# EasyEDA Pro project 无刷双驱.epro, board PCB3
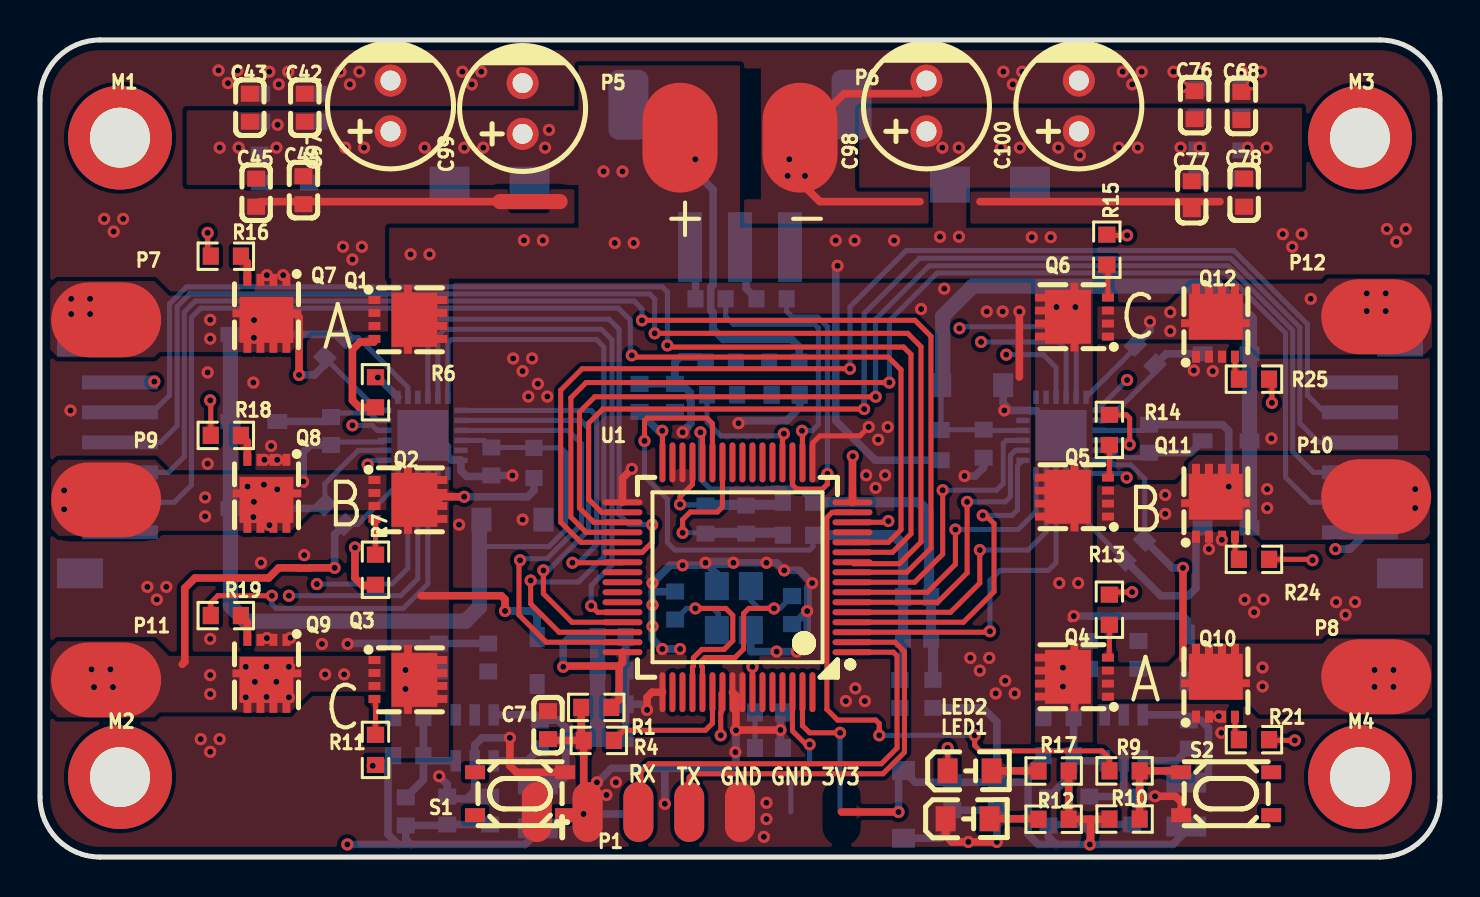
[diagram p2: board, top side]
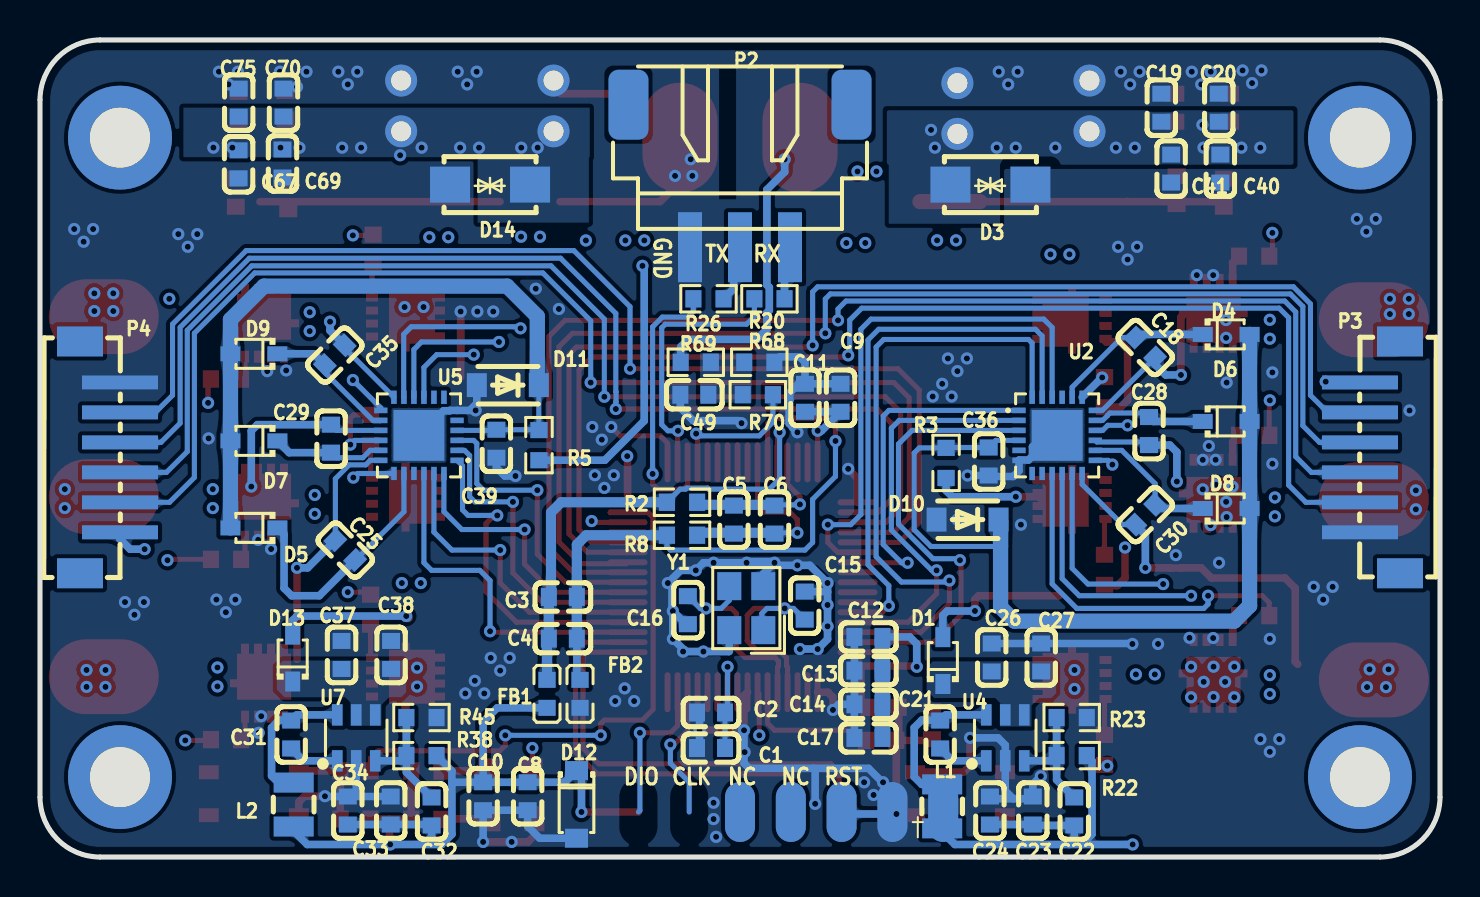
[diagram p3: board, bottom side, seen from below]

Outline 70 x 40.89 mm; copper layers: Top Layer, VCC, GND, Bottom Layer. Coordinates in mm from the lower left corner of the outline.
Outline path: 0,37.89 0,3 arc(0.88,0.88) 3,0 67,0 arc(69.12,0.88) 70,3 70,37.89 arc(69.12,40.01) 67,40.89 3,40.89 arc(0.88,40.01) 0,37.89
Stack: Top Layer 0.035mm 外层铜厚1oz / Dielectric1 0.2104mm 7628 RC49% 8.6mil / VCC 0.0152mm 内层铜厚 / Dielectric2 1.065mm 1.1mm H/HOZ Copper / GND 0.0152mm 内层铜厚 / Dielectric3 0.2104mm 7628 RC49% 8.6mil / Bottom Layer 0.035mm 外层铜厚1oz

## Design rules (mm)
net ECO_OUT: DP1
net ECO_IN: DP1
template: 自定义配置
spacing copperThickness1oz (default): track to track 0.102, other pairs 0.152 to 0.3
spacing copperThickness2oz: track to track 0.203, other pairs 0.152 to 0.3
track width copperThickness1oz (default): min 0.127, default 0.381, max 2.54
track width copperThickness2oz: min 0.203, default 0.254, max 2.54
differential pair differentialPair (default): width min 0.127, default 0.254, max 2.54; gap min 0.152, default 0.152
via viaSize (default): diameter min 0.5, default 0.61, max 10; hole min 0.3, default 0.305, max 6.299

## Placement (name value [footprint] x y rotation side)
C1  4.7uF  [C0603]  36.45 5.46 0 bottom
C2  100nF  [C0603]  36.45 7.23 0 bottom
C3  4.7uF  [C0603]  43.86 13.02 180 bottom
C4  100nF  [C0603]  43.86 10.93 0 bottom
C5  2.2uF  [C0603]  35.31 16.89 90 bottom
C6  100nF  [C0603]  33.27 16.89 270 bottom
C7  100nF  [C0603]  25.4 6.6 270 top
C8  4.7uF  [C0603]  45.62 3.04 270 bottom
C9  4.7uF  [C0603]  29.97 22.98 90 bottom
C10  100nF  [C0603]  47.84 3.04 270 bottom
C11  100nF  [C0603]  31.75 22.98 90 bottom
C12  4.7uF  [C0603]  28.58 11.01 180 bottom
C13  100nF  [C0603]  28.58 9.33 180 bottom
C14  4.7uF  [C0603]  28.58 7.64 180 bottom
C15  10pF  [C0603]  31.76 12.58 270 bottom
C16  10pF  [C0603]  37.61 12.35 270 bottom
C17  100nF  [C0603]  28.58 5.96 180 bottom
C18  4.7uF  [C0603]  14.74 25.5 225 bottom
C19  22uF  [C0603]  13.94 37.5 90 bottom
C20  22uF  [C0603]  11.06 37.5 90 bottom
C21  100nF  [C0603]  24.99 6.13 90 bottom
C22  220pF  [C0603]  18.29 2.28 270 bottom
C23  22uF  [C0603]  20.36 2.33 270 bottom
C24  100nF  [C0603]  22.5 2.33 270 bottom
C25  4.7uF  [C0603]  54.74 15.36 45 bottom
C26  22uF  [C0603]  22.41 9.99 90 bottom
C27  100nF  [C0603]  19.94 9.99 90 bottom
C28  4.7uF  [C0603]  14.55 21.32 270 bottom
C29  4.7uF  [C0603]  55.45 20.94 90 bottom
C30  4.7uF  [C0603]  14.74 17.13 315 bottom
C31  100nF  [C0603]  57.44 6.13 90 bottom
C32  220pF  [C0603]  50.42 2.28 270 bottom
C33  22uF  [C0603]  52.46 2.33 270 bottom
C34  100nF  [C0603]  54.61 2.33 270 bottom
C35  4.7uF  [C0603]  55.26 25.12 135 bottom
C36  22uF  [C0603]  22.57 19.79 270 bottom
C37  22uF  [C0603]  54.92 10.11 90 bottom
C38  100nF  [C0603]  52.45 10.11 90 bottom
C39  22uF  [C0603]  47.18 20.68 270 bottom
C40  22uF  [C0603]  10.98 34.45 270 bottom
C41  22uF  [C0603]  13.44 34.45 270 bottom
C42  22uF  [C0603]  13.24 37.5 90 top
C43  22uF  [C0603]  10.49 37.5 90 top
C44  22uF  [C0603]  13.17 33.37 270 top
C45  22uF  [C0603]  10.81 33.25 270 top
C49  100nF  [C0603]  37.28 23.14 180 bottom
C67  22uF  [C0603]  60.07 34.67 90 bottom
C68  22uF  [C0603]  60.07 37.59 270 top
C69  22uF  [C0603]  57.87 34.71 90 bottom
C70  22uF  [C0603]  57.83 37.75 270 bottom
C75  22uF  [C0603]  60.06 37.75 270 bottom
C76  22uF  [C0603]  57.73 37.63 270 top
C77  22uF  [C0603]  57.59 33.12 90 top
C78  22uF  [C0603]  60.21 33.25 90 top
C97  220uF  [CAP-TH_BD6.3-P2.50-D1.0-FD]  17.53 37.59 90 top
C98  220uF  [CAP-TH_BD6.3-P2.50-D1.0-FD]  44.32 37.59 90 top
C99  220uF  [CAP-TH_BD6.3-P2.50-D1.0-FD]  24.13 37.46 90 top
C100  220uF  [CAP-TH_BD6.3-P2.50-D1.0-FD]  51.94 37.59 90 top
D1  B5819WS-TP  [SOD-323_L1.8-W1.3-LS2.5-RD]  24.86 9.83 90 bottom
D3  SMAJ16CA  [SMA_L4.4-W2.6-LS5.0-BI]  22.48 33.65 180 bottom
D4  B5819WS-TP  [SOD-323_L1.8-W1.3-LS2.5-RD]  10.69 26.15 180 bottom
D5  B5819WS-TP  [SOD-323_L1.8-W1.3-LS2.5-RD]  59.3 16.47 0 bottom
D6  B5819WS-TP  [SOD-323_L1.8-W1.3-LS2.5-RD]  10.69 21.8 180 bottom
D7  B5819WS-TP  [SOD-323_L1.8-W1.3-LS2.5-RD]  59.3 20.83 0 bottom
D8  B5819WS-TP  [SOD-323_L1.8-W1.3-LS2.5-RD]  10.69 17.44 180 bottom
D9  B5819WS-TP  [SOD-323_L1.8-W1.3-LS2.5-RD]  59.3 25.18 0 bottom
D10  BZT52C15-7-F  [SOD-123F_L2.8-W1.8-LS3.7-RD]  23.62 16.89 0 bottom
D11  BZT52C15-7-F  [SOD-123F_L2.8-W1.8-LS3.7-RD]  46.61 23.62 0 bottom
D12  SMF3.3A  [SOD-123_L2.8-W1.8-LS3.7-RD]  43.17 2.64 270 bottom
D13  B5819WS-TP  [SOD-323_L1.8-W1.3-LS2.5-RD]  57.37 9.96 90 bottom
D14  SMAJ16CA  [SMA_L4.4-W2.6-LS5.0-BI]  47.5 33.65 180 bottom
FB1  BLM18PG121SN1D  [L0603]  44.65 8.17 90 bottom
FB2  BLM18PG121SN1D  [L0603]  43 8.17 90 bottom
L1  4.7uH  [IND-SMD_L2.5-W2.0_YXMBL252010P]  24.89 2.53 90 bottom
L2  4.7uH  [IND-SMD_L2.5-W2.0_YXMBL252010P]  57.32 2.63 90 bottom
LED1  YLED0805R  [LED0805-RD]  46.38 1.91 0 top
LED2  YLED0805R  [LED0805-RD]  46.48 4.31 0 top
M1  MountHole  [M3-MountHole-Plated]  4 36 0 top
M2  MountHole  [M3-MountHole-Plated]  4 4 0 top
M3  MountHole  [M3-MountHole-Plated]  66 36 0 top
M4  MountHole  [M3-MountHole-Plated]  66 4 0 top
P1  -  [HDR-M-2.54-2x5-DS]  35 2.25 270 top
P2  XH2.54-3P  [XH2.54-3P-SH]  35 35.5 0 bottom
P3  HX15001-6AB  [CONN-SMD_HX15001-6AB]  3 20 90 bottom
P4  HX15001-6AB  [CONN-SMD_HX15001-6AB]  67 20 270 bottom
P5  WirePad  [WirePad-4x6]  32 36 90 top
P6  WirePad  [WirePad-4x6]  38 36 90 top
P7  WirePad  [WirePad-4x6]  3.31 26.88 0 top
P8  WirePad  [WirePad-4x6]  66.81 9.02 0 top
P9  WirePad  [WirePad-4x6]  3.31 17.88 0 top
P10  WirePad  [WirePad-4x6]  66.81 18.03 0 top
P11  WirePad  [WirePad-4x6]  3.31 8.87 0 top
P12  WirePad  [WirePad-4x6]  66.81 27.04 0 top
Q1  TPN2R703NL,L1Q(M  [TSON-8_L3.1-W3.1-P0.65-LS3.3-BL-EP]  18.4 26.9 270 top
Q2  TPN2R703NL,L1Q(M  [TSON-8_L3.1-W3.1-P0.65-LS3.3-BL-EP]  18.4 17.89 270 top
Q3  TPN2R703NL,L1Q(M  [TSON-8_L3.1-W3.1-P0.65-LS3.3-BL-EP]  18.4 8.89 270 top
Q4  TPN2R703NL,L1Q(M  [TSON-8_L3.1-W3.1-P0.65-LS3.3-BL-EP]  51.72 9 90 top
Q5  TPN2R703NL,L1Q(M  [TSON-8_L3.1-W3.1-P0.65-LS3.3-BL-EP]  51.72 18.01 90 top
Q6  TPN2R703NL,L1Q(M  [TSON-8_L3.1-W3.1-P0.65-LS3.3-BL-EP]  51.72 27.02 90 top
Q7  TPN2R703NL,L1Q(M  [TSON-8_L3.1-W3.1-P0.65-LS3.3-BL-EP]  11.34 27.21 180 top
Q8  TPN2R703NL,L1Q(M  [TSON-8_L3.1-W3.1-P0.65-LS3.3-BL-EP]  11.34 18.2 180 top
Q9  TPN2R703NL,L1Q(M  [TSON-8_L3.1-W3.1-P0.65-LS3.3-BL-EP]  11.34 9.19 180 top
Q10  TPN2R703NL,L1Q(M  [TSON-8_L3.1-W3.1-P0.65-LS3.3-BL-EP]  58.77 8.7 0 top
Q11  TPN2R703NL,L1Q(M  [TSON-8_L3.1-W3.1-P0.65-LS3.3-BL-EP]  58.77 17.71 0 top
Q12  TPN2R703NL,L1Q(M  [TSON-8_L3.1-W3.1-P0.65-LS3.3-BL-EP]  58.77 26.71 0 top
R1  10kΩ  [R0603]  27.81 7.49 180 top
R2  0R  [R0603]  37.9 17.75 180 bottom
R3  100R  [R0603]  24.7 19.72 270 bottom
R4  100Ω  [R0603]  27.94 5.84 180 top
R5  100R  [R0603]  45.05 20.61 270 bottom
R6  4.7R  [R0603]  16.78 23.26 90 top
R7  4.7R  [R0603]  16.78 14.38 270 top
R8  0R  [R0603]  37.9 16.1 180 bottom
R9  100R  [R0603]  54.23 4.31 0 top
R10  4.7K  [R0603]  54.23 1.9 0 top
R11  4.7R  [R0603]  16.78 5.36 270 top
R12  1kΩ  [R0603]  50.68 1.89 180 top
R13  4.7R  [R0603]  53.47 12.38 90 top
R14  4.7R  [R0603]  53.47 21.38 90 top
R15  4.7R  [R0603]  53.34 30.39 90 top
R16  4.7R  [R0603]  9.29 30.07 180 top
R17  1kΩ  [R0603]  50.68 4.3 180 top
R18  4.7R  [R0603]  9.29 21.1 180 top
R19  4.7R  [R0603]  9.29 12.08 180 top
R20  100R  [R0603]  33.53 27.94 0 bottom
R21  4.7R  [R0603]  60.7 5.87 0 top
R22  73.2K  [R0603]  18.41 5.08 180 bottom
R23  10K  [R0603]  18.41 6.98 0 bottom
R24  4.7R  [R0603]  60.7 14.9 0 top
R25  4.7R  [R0603]  60.7 23.92 0 top
R26  100R  [R0603]  36.58 27.94 0 bottom
R38  45.3K  [R0603]  50.93 5.08 180 bottom
R45  10K  [R0603]  50.93 6.98 0 bottom
R68  1kΩ  [R0603]  34.04 24.76 0 bottom
R69  10kΩ  [R0603]  37.21 24.76 0 bottom
R70  100R  [R0603]  34.11 23.14 180 bottom
S1  TS1145A26025  [SW-SMD_4P-L4.2-W3.2-P2.15-LS4.6]  24 3.17 180 top
S2  TS1145A26025  [SW-SMD_4P-L4.2-W3.2-P2.15-LS4.6]  59.31 3.17 0 top
U1  CYT2BL3CAAQ0AZEGST  [LQFP-64_L10.0-W10.0-P0.50-LS12.0-BL]  34.87 14 90 top
U2  FD6288Q  [QFN-24_L4.0-W4.0-P0.50-BL-EP2.6]  19.14 21.1 270 bottom
U4  RY9121E  [SOT-23-6_L2.9-W1.6-P0.95-LS2.8-BL]  21.74 5.96 180 bottom
U5  FD6288Q  [QFN-24_L4.0-W4.0-P0.50-BL-EP2.6]  51.05 21.1 90 bottom
U7  RY9121E  [SOT-23-6_L2.9-W1.6-P0.95-LS2.8-BL]  54.19 5.96 180 bottom
Y1  20pF16MHz  [CRYSTAL-SMD_4P-L3.2-W2.5-BL]  34.69 12.45 90 bottom

## Footprints (pads in the part's own frame, mm; a bottom-side part is the same pattern mirrored in y, then rotated)
C0603
  rect 0.8x0.9 smd: 1(-0.7,0) 2(0.7,0)
CAP-TH_BD6.3-P2.50-D1.0-FD
  round 1.6 hole 1: 1(-1.27,0) 2(1.27,0)
CONN-SMD_HX15001-6AB
  rect 0.7x3.8 smd: 1(-3.75,1) 2(-2.25,1) 3(-0.75,1) 4(0.75,1) 5(2.25,1) 6(3.75,1)
  rect 1.5x2.3 smd: 7(5.8,-1) 8(-5.8,-1)
CRYSTAL-SMD_4P-L3.2-W2.5-BL
  rect 1.4x1.2 smd: 1(-1.1,-0.85) 2(1.1,-0.85) 3(1.1,0.85) 4(-1.1,0.85)
HDR-M-2.54-2x5-DS
  oval 3x1.5 smd: 1(0,0) 3(0,-2.54) 5(0,-5.08) 7(0,-7.62) 9(0,-10.16)
  oval 3x1.5 smd far side: 2(0,0) 4(0,-2.54) 6(0,-5.08) 8(0,-7.62) 10(0,-10.16)
IND-SMD_L2.5-W2.0_YXMBL252010P
  rect 1x2 smd: 1(1.1,0) 2(-1.1,0)
L0603
  rect 0.8x0.864 smd: 1(-0.7,0) 2(0.7,0)
LED0805-RD
  rect 1x1.25 smd: 1(-1.1,0) 2(1.1,0)
LQFP-64_L10.0-W10.0-P0.50-LS12.0-BL
  oval 0.3x2 smd: 1(-3.75,-5.75) 2(-3.25,-5.75) 3(-2.75,-5.75) 4(-2.25,-5.75) 5(-1.75,-5.75) 6(-1.25,-5.75) 7(-0.75,-5.75) 8(-0.25,-5.75) 9(0.25,-5.75) 10(0.75,-5.75) 11(1.25,-5.75) 12(1.75,-5.75) 13(2.25,-5.75) 14(2.75,-5.75) 15(3.25,-5.75) 16(3.75,-5.75) 33(3.75,5.75) 34(3.25,5.75) 35(2.75,5.75) 36(2.25,5.75) 37(1.75,5.75) 38(1.25,5.75) 39(0.75,5.75) 40(0.25,5.75) 41(-0.25,5.75) 42(-0.75,5.75) 43(-1.25,5.75) 44(-1.75,5.75) 45(-2.25,5.75) 46(-2.75,5.75) 47(-3.25,5.75) 48(-3.75,5.75)
  oval 2x0.3 smd: 17(5.75,-3.75) 18(5.75,-3.25) 19(5.75,-2.75) 20(5.75,-2.25) 21(5.75,-1.75) 22(5.75,-1.25) 23(5.75,-0.75) 24(5.75,-0.25) 25(5.75,0.25) 26(5.75,0.75) 27(5.75,1.25) 28(5.75,1.75) 29(5.75,2.25) 30(5.75,2.75) 31(5.75,3.25) 32(5.75,3.75) 49(-5.75,3.75) 50(-5.75,3.25) 51(-5.75,2.75) 52(-5.75,2.25) 53(-5.75,1.75) 54(-5.75,1.25) 55(-5.75,0.75) 56(-5.75,0.25) 57(-5.75,-0.25) 58(-5.75,-0.75) 59(-5.75,-1.25) 60(-5.75,-1.75) 61(-5.75,-2.25) 62(-5.75,-2.75) 63(-5.75,-3.25) 64(-5.75,-3.75)
M3-MountHole-Plated
  round 5.2 hole 3: 1(0,0)
QFN-24_L4.0-W4.0-P0.50-BL-EP2.6
  rect 0.28x0.665 smd: 1(-1.25,-1.907) 2(-0.75,-1.907) 3(-0.25,-1.907) 4(0.25,-1.907) 5(0.75,-1.907) 6(1.25,-1.907) 13(1.25,1.907) 14(0.75,1.907) 15(0.25,1.907) 16(-0.25,1.907) 17(-0.75,1.907) 18(-1.25,1.907)
  rect 0.665x0.28 smd: 7(1.907,-1.25) 8(1.907,-0.75) 9(1.907,-0.25) 10(1.907,0.25) 11(1.907,0.75) 12(1.907,1.25) 19(-1.907,1.25) 20(-1.907,0.75) 21(-1.907,0.25) 22(-1.907,-0.25) 23(-1.907,-0.75) 24(-1.907,-1.25)
  rect 2.55x2.55 smd: 25(0,0)
R0603
  rect 0.806x0.864 smd: 1(-0.753,0) 2(0.753,0)
SMA_L4.4-W2.6-LS5.0-BI
  rect 2x1.8 smd: 1(-2,0) 2(2,0)
SOD-123_L2.8-W1.8-LS3.7-RD
  rect 0.95x1.15 smd: 1(-1.692,0) 2(1.692,0)
SOD-123F_L2.8-W1.8-LS3.7-RD
  rect 1x1.2 smd: 1(-1.55,0) 2(1.55,0)
SOD-323_L1.8-W1.3-LS2.5-RD
  rect 1x0.75 smd: 1(-1.173,0) 2(1.173,0)
SOT-23-6_L2.9-W1.6-P0.95-LS2.8-BL
  rect 0.532x1.072 smd: 1(-0.95,-1.149) 2(0,-1.149) 3(0.95,-1.149) 4(0.95,1.149) 5(0,1.149) 6(-0.95,1.149)
SW-SMD_4P-L4.2-W3.2-P2.15-LS4.6
  rect 1x0.7 smd: 1(-2.25,1.075) 2(2.25,1.075) 3(-2.25,-1.075) 4(2.25,-1.075)
TSON-8_L3.1-W3.1-P0.65-LS3.3-BL-EP
  rect 0.4x0.6 smd: 1(-0.975,-1.675) 2(-0.325,-1.675) 3(0.325,-1.675) 4(0.975,-1.675) 5(0.975,1.675) 6(0.325,1.675) 7(-0.325,1.675) 8(-0.975,1.675)
  rect 0.6x0.4 smd: 9(-1.42,0) 9(1.42,0)
  rect 2.7x2.3 smd: 9(0.02,0.325)
WirePad-4x6
  rrect 5.5x3.75 smd: 1(0,0)
XH2.54-3P-SH
  rrect 2x3.5 smd: 0(-5.577,-2.15) 0(5.577,-2.15)
  rect 1.2x3.5 smd: 1(-2.5,4.981) 2(0,4.981) 3(2.5,4.981)

## Nets
As in the schematic.

Pads without a net: M1 1; M2 1; M3 1; M4 1; P1 6 8; P2 0; P3 7 8; P4 7 8; S1 2 4; S2 2 4; U1 13 21 22 23 24 25 30 31 40 41 42 43 50 51 59 60 61 64; U2 5 7 8 21; U5 5 7 8 21

## Via types
v1: diameter 0.61, hole 0.305, Top Layer to Bottom Layer, 316 vias

## Routing (per net, layer and track width the routed paths; a pad name or vN(x,y) marks a point on that pad's centre or on a via; arc(x,y) is an arc through that point)
GND: length 161.5
  Top Layer w0.254: v1(41.44,21.52) 40.99,21.08 38.99,21.08 38.62,20.71 U1.17
  Top Layer w0.381: 11,32.8 23,32.8 ; U1.56 34.8,8.08 v1(34.8,6.34) 34.81,6.36 v1(37.02,6.36) ; v1(47.84,0.76) v1(46.42,0.76) 45.59,0.76 45.28,1.07 LED1.1 ; 47,32.8 59,32.8 ; v1(55.75,3.04) 56.77,3.04 57.06,2.75 S2.3 ; v1(30.35,7.36) 30.35,8 30.61,8.25 U1.49 ; S1.3 23.82,4.25 23.5,4.57 v1(23.5,5.96) ; 44,32.8 38.99,32.8 38,33.79 P6.1 40.2,38.2 44,38.2 ; v1(29.59,19.43) 29.12,18.96 U1.33 ; 48.97,24.02 v1(48.97,27.3)
  Top Layer w0.762: 23,32.8 26,32.8
  Bottom Layer w0.381: v1(34.67,14.73) v1(36.32,14.73) 36.83,14.73 v1(37.21,14.35) 37.97,14.35 v1(38.61,13.71) 38.4,13.5 38.4,12.51 38.36,12.47 v1(38.36,12.31) ; C1.2 37.02,5.58 v1(37.02,6.36) 37.02,7.11 C2.2 ; R68.1 33.01,25.03 32.02,25.03 31.75,24.76 C11.2 ; v1(46.23,19.07) 46.76,19.07 47.18,19.49 C39.2 ; v1(38.36,12.31) 38.36,10.92 v1(38.35,10.92) 37.85,10.41 v1(37.85,10.28) v1(36.83,10.28) 35.56,10.28 35.53,10.31 Y1.4 ; v1(38.36,12.31) 37.7,11.65 C16.2 ; 30.62,13.26 v1(30.62,13.71) 31.51,14.6 v1(32.13,14.6) 33.15,14.6 v1(33.27,14.73) 33.84,14.17 33.84,13.56 ; 30.62,13.26 v1(30.62,12.61) v1(30.62,11.55) 30.62,10.9 v1(31.12,10.41) v1(32,10.41) ; 30.62,13.26 30.65,13.28 C15.1 ; C14.1 30.07,7.64 v1(30.35,7.36) ; C14.1 C13.1 C12.1 ; C14.1 C17.1 ; v1(55.75,3.04) 55.74,3.03 C34.1 ; U7.2 54.19,3.12 ; D11.2 48.16,22.7 48.51,22.35 U5.6 49.5,22.35 49.52,22.33 49.82,22.33 U5.25 ; v1(32.13,21.25) 32.37,21.5 32.37,21.52 32.54,21.69 32.54,22.82 32.51,22.86 32.51,23.24 32.07,23.68 C11.2 ; C9.2 C11.2 ; v1(15.38,10.66) 15.4,10.69 C27.2 C26.2 ; C24.1 22.39,2.92 21.34,2.92 ; 54.54,2.96 54.47,3.03 C33.1 ; v1(47.84,0.76) C10.2 C8.2 45.62,1.54 45.02,0.94 D12.2 ; 31.33,4.44 34.54,4.44 34.8,4.69 v1(34.8,6.34) ; 31.33,4.44 31.24,4.35 v1(31.24,2.66) ; 31.33,4.44 28.57,4.44 27.88,3.74 v1(27.85,3.74) ; v1(23.62,19.09) C36.2 22.52,19.05 21.34,19.05 21.05,19.33 U2.6 21.03,19.87 20.58,19.87 20.37,20.07 20.37,20.53 19.8,21.1 U2.25 ; v1(34.93,21.71) 35.05,21.84 37.33,21.84 37.98,22.48 C49.1 ; v1(23.5,5.96) 22.1,5.96 21.74,5.6 U4.2 21.74,3.32 21.34,2.92 ; 21.34,2.92 20.47,2.92 C23.1 20.36,3.64 v1(19.96,4.04)
  Bottom Layer w0.508: v1(34.67,14.73) v1(33.27,14.73)
  vias: v1(1.52,22.35) v1(3.21,31.94) v1(3.68,31.3) v1(4.16,31.94) v1(5.37,13.52) v1(5.84,12.89) v1(6.32,13.52) v1(8.04,5.9) v1(8.38,24.25) v1(8.38,19.68) v1(8.51,10.92) v1(8.51,5.27) v1(8.92,39.36) v1(8.98,5.9) v1(9.4,38.73) v1(9.87,39.36) v1(10.67,23.74) v1(11.05,14.73) v1(11.22,19.88) v1(11.34,29.12) v1(11.34,10.96) v1(11.46,39.3) v1(11.56,20.57) v1(11.94,38.67) v1(11.86,19.88) v1(12.16,29.12) v1(12.41,39.3) v1(12.52,10.97) v1(13.21,15.11) v1(14.1,10.66) v1(15.02,39.3) v1(15.15,30.54) v1(15.49,38.67) v1(15.62,29.9) v1(15.97,39.3) v1(16.09,30.54) v1(20.96,16.63) v1(21.12,39.3) v1(21.59,38.67) v1(22.06,39.3) v1(23.66,24.95) v1(24.13,24.32) v1(24.13,16.89) v1(24.42,23.05) v1(24.6,24.95) v1(24.89,23.68) v1(25.37,23.05) v1(28.32,3.11) v1(28.79,3.74) v1(34.77,5.25) v1(36.19,1.01) v1(36.32,2.72) v1(36.32,1.9) v1(37.38,34.09) v1(37.47,34.92) v1(38.25,34.09) v1(40.29,7.81) v1(40.77,8.44) v1(41.24,7.81) v1(41.31,19.11) v1(41.78,18.47) v1(41.91,20.89) v1(42.26,19.11) v1(42.38,21.52) v1(44.06,27.43) v1(45.21,28.44) v1(46.52,9.96) v1(46.99,9.33) v1(47.34,27.3) v1(47.46,9.96) v1(47.79,8.19) v1(48.13,27.3) v1(48.17,39.3) v1(48.22,22.35) v1(48.26,8.82) v1(48.64,38.67) v1(48.73,8.19) v1(49.11,39.3) v1(54.14,39.3) v1(54.61,38.67) v1(55.08,39.3) v1(56.68,39.3) v1(57.15,38.54) v1(57.69,24.35) v1(58,39.3) v1(58.45,15.41) v1(58.64,24.32) v1(58.94,7.05) v1(59.09,15.87) v1(59.07,6.22) v1(60.11,39.3) v1(60.23,12.89) v1(60.58,38.67) v1(60.71,12.25) v1(61.05,39.3) v1(61.18,12.89) v1(61.57,20.95) v1(62.14,31.17) v1(62.61,30.54) v1(63.08,31.17) v1(64.8,12.76) v1(65.28,12.12) v1(65.75,12.76) v1(67.34,31.43) v1(67.82,30.79) v1(68.29,31.43)
VBAT: length 49.6
  Top Layer w0.381: v1(21.21,18.03) 20.07,18.03 19.94,17.9 ; P5.1 32.77,35.23 v1(32.77,34.92) ; v1(23.25,12.31) 23.25,12.89 23.07,13.08 19.05,13.08 ; v1(51.69,12.06) 51.56,11.93
  Bottom Layer w0.381: v1(39.88,29.59) 39.79,29.5 39.79,21.83 41.76,19.86 45.05,19.86 ; v1(23.25,12.31) 24.64,12.31 24.86,12.09 D1.2 ; D13.2 57.37,11.84 57.15,12.06 v1(51.69,12.06) ; R3.2 24.7,18.34 24.38,18.03 v1(21.21,18.03) ; R69.2 37.96,25.53 37.59,25.9 34.16,25.9 33.66,26.41 33.66,27.24 33.53,27.36 33.53,28.51 33.66,28.63 33.66,33.4 32.77,34.28 v1(32.77,34.92)
  vias: v1(8.99,35.5) v1(9.93,35.5) v1(11.82,35.5) v1(11.88,36.64) v1(15.26,35.5) v1(16.2,35.5) v1(18.28,9.36) v1(18.28,8.41) v1(18.53,30.16) v1(19.23,35.5) v1(19.48,30.16) v1(21.22,35.5) v1(22.16,35.5) v1(24.2,30.86) v1(25.15,30.86) v1(25.25,35.5) v1(25.45,36.39) v1(28.18,34.31) v1(28.74,30.73) v1(29.12,34.31) v1(29.68,30.73) v1(39.79,30.86) v1(40.73,30.86) v1(42.71,30.86) v1(45,31.04) v1(45.12,35.5) v1(45.94,35.5) v1(45.95,31.04) v1(48.05,35.5) v1(48.99,35.5) v1(49.59,31.02) v1(50.53,31.02) v1(50.82,27.52) v1(50.92,35.5) v1(50.96,13.71) v1(51.15,9.48) v1(51.15,8.53) v1(51.77,27.52) v1(51.91,13.71) v1(51.99,35.12) v1(53.94,35.5) v1(54.89,35.5) v1(57.03,35.5) v1(57.97,35.5) v1(60.38,35.5) v1(61.33,35.5)
VCC1V1: length 5.4
  Top Layer w0.254: U1.58 v1(35.62,9.52)
  Bottom Layer w0.254: v1(35.62,9.52) 35.62,7.36 35.75,7.23 35.75,5.46
VCC3V3: length 115.1
  Top Layer w0.254: v1(34.04,6.09) 34.04,7.21 34.05,7.22 34.05,8.18 U1.55 ; U1.32 31.12,21.32 v1(31.12,21.33)
  Top Layer w0.381: 28.96,9.56 29.12,9.73 U1.48 ; 28.96,9.56 26.2,9.56 v1(26.16,9.52) ; 28.96,9.56 28.96,7.88 R1.1 ; 52.53,1.89 52.53,0.67 v1(52.49,0.63) ; 52.53,1.89 R12.1 R17.1 ; 52.53,1.89 53.47,1.89 R10.1 ; v1(40.64,20.06) 40.62,20.04 U1.16 ; 40.08,2.25 v1(42.93,2.25)
  VCC w0.381: 31.12,20.08 26.05,20.08 25.78,19.81 25.78,14.65 26.16,14.27 v1(26.16,9.52) 26.16,6.34 26.42,6.09 v1(34.04,6.09) 34.04,4.95 34.93,4.06 42.66,4.06 42.93,3.79 v1(42.93,2.25) ; 31.12,20.08 v1(31.12,21.33) ; 31.12,20.08 40.62,20.08 v1(40.64,20.06)
  Bottom Layer w0.381: 50.8,0.63 50.42,1.01 50.42,1.58 50.47,1.63 C33.2 C34.2 ; 50.8,0.63 v1(52.49,0.63) 56.64,0.63 57.32,1.3 L2.2 ; 50.8,0.63 49.91,0.63 49.4,1.14 49.4,3.78 ; FB1.1 47.14,7.47 47.84,6.76 C10.1 ; v1(31.12,21.33) 30.92,21.33 C9.1 C11.1 ; 49.4,3.78 49.4,4.3 R38.2 ; 49.4,3.78 49.37,3.74 C10.1 ; C12.2 26.51,11.01 26.16,10.66 v1(26.16,9.52) ; C10.1 C8.1 43.76,3.74 D12.1 42.93,4.08 v1(42.93,2.25)
  Bottom Layer w0.762: C12.2 C13.2 C14.2 C17.2
VCC5V: length 145.3
  VCC w0.381: 22.61,32.38 21.46,31.24 14.22,31.24 13.08,32.38 7.75,32.38 5.72,30.35 v1(5.72,23.79) ; 22.61,32.38 63.75,32.38 64.77,31.36 v1(64.77,15.41) ; 22.61,32.38 22.61,3.93 21.59,2.92 16.13,2.92 15.37,2.15 v1(15.37,0.63)
  Bottom Layer w0.381: 18.54,0.63 24.26,0.63 24.89,1.26 L1.2 ; 18.54,0.63 17.91,0.63 ; 18.54,0.63 18.29,0.88 18.29,1.58 20.31,1.58 C23.2 C24.2 ; 17.91,0.63 v1(15.37,0.63) ; 17.91,0.63 17.4,1.14 17.4,4.81 R22.2 ; P3.6 5.68,23.75 v1(5.72,23.79) ; v1(64.77,15.41) 65.5,15.41 66,15.91 P4.6
VDDA: length 24.5
  Top Layer w0.254: v1(33.02,21.25) 33.12,21.15 U1.28
  Bottom Layer w0.254: R2.1 38,18.41 37.72,18.41 37.66,18.47 36.63,18.47 36.57,18.41 33.53,18.41 33.02,18.92 v1(33.02,21.25)
  Bottom Layer w0.508: R2.1 43.94,17.75 44.45,17.25 44.45,13.12 C3.1 C4.2 44.65,10.84 44.65,8.86
VSSA: length 31.7
  Top Layer w0.254: v1(30.23,20.82) 30.23,21.84 30.35,21.97 33.35,21.97 33.62,21.69 U1.27
  Bottom Layer w0.254: v1(30.23,20.82) 30.23,19.05 31.37,17.9 31.37,15.74 31.75,15.36 38.48,15.36 38.65,15.53 R8.1
  Bottom Layer w0.381: C4.1 43.16,9.02 43,8.86
  Bottom Layer w0.508: C4.1 C3.2 43.16,15.64 42.69,16.1 R8.1
BATADC: length 7.3
  Top Layer w0.254: v1(37.19,21.19) 37.12,21.12 U1.20
  Bottom Layer w0.254: v1(37.19,21.19) 37.08,21.08 34.04,21.08 33.35,21.76 33.35,23.39
DBG_RX: length 22.3
  Top Layer w0.254: U1.1 42.67,10.25 42.85,10.07 42.85,5.45 42.06,4.67 30.45,4.67 30.05,4.26 30.05,2.38 29.92,2.25
DBG_TX: length 20.8
  Top Layer w0.254: U1.2 42.75,10.75 43.22,10.28 43.22,5.25 42.14,4.17 32.64,4.17 32.46,3.99 32.46,2.25
ECD1_CS: length 60.9
  Top Layer w0.254: v1(29.59,25.11) 29.68,25.02 42.41,25.02 43.05,24.38 43.05,16.38 42.42,15.75 U1.12
  Bottom Layer w0.254: P3.2 6.71,17.75 7.57,18.61 7.57,27 8.04,27.47 28.91,27.47 29.51,26.87 29.51,25.18 v1(29.59,25.11)
ECD1_MISO: length 64.4
  Top Layer w0.254: v1(30.1,26.86) 43.75,26.86 44.55,26.06 44.55,15.46 43.34,14.25 U1.9
  Bottom Layer w0.254: P3.3 6.43,19.25 7.21,20.04 7.21,27.27 7.76,27.82 29.7,27.82 30.1,27.43 v1(30.1,26.86)
ECD1_MOSI: length 62.4
  Top Layer w0.254: v1(30.73,26.21) 43.38,26.21 44.05,25.54 44.05,15.76 42.97,14.68 40.69,14.68 U1.10
  Bottom Layer w0.254: P3.4 6.02,20.75 6.86,21.58 6.86,27.55 7.48,28.18 30.48,28.18 30.73,27.93 v1(30.73,26.21)
ECD1_SCLK: length 60.1
  Top Layer w0.254: U1.11 42.62,15.25 43.55,16.17 43.55,25.15 43.18,25.52 31.45,25.52 v1(31.37,25.61)
  Bottom Layer w0.254: P3.5 5.62,22.25 6.48,23.11 6.48,27.68 7.33,28.54 31.12,28.54 31.37,28.28 v1(31.37,25.61)
ECD2_CS: length 60.2
  Top Layer w0.254: U1.37 27.04,15.75 26.03,16.76 26.03,23.36 27.11,24.44 v1(40.5,24.44)
  Bottom Layer w0.254: v1(40.5,24.44) 40.5,27.54 43.31,30.35 59.69,30.35 63.37,26.67 63.37,23.11 64.23,22.25 P4.2
ECD2_MISO: length 57.2
  Top Layer w0.254: v1(41.21,22.42) 28.14,22.42 27.43,21.71 27.43,17.9 28.08,17.25 U1.34
  Bottom Layer w0.254: v1(41.21,22.42) 41.21,22.78 41.2,22.79 41.2,23.28 41.21,23.28 41.21,27.2 43.97,29.97 59.53,29.97 62.99,26.51 62.99,21.71 63.95,20.75 P4.3
ECD2_MOSI: length 59.4
  Top Layer w0.254: v1(41.78,23.03) 27.74,23.03 26.97,22.27 26.97,17.47 27.69,16.75 U1.35
  Bottom Layer w0.254: P4.4 63.68,19.25 62.64,20.29 62.64,26.36 59.41,29.59 44.45,29.59 41.78,26.92 v1(41.78,23.03)
ECD2_SCLK: length 61.7
  Top Layer w0.254: 29.12,16.25 27.31,16.25 26.54,17.01 26.54,22.98 27.31,23.74 v1(42.47,23.74)
  Bottom Layer w0.254: P4.5 63.53,17.75 62.28,18.99 62.28,26.21 59.26,29.23 44.86,29.23 42.47,26.84 v1(42.47,23.74)
ECO_IN: length 10.7
  Top Layer w0.254: U1.52 32.62,9.5 32.67,9.55 32.67,9.97 33.09,10.39 34.21,10.39 34.64,10.82 34.64,12.09 34.29,12.44 v1(32.77,12.44)
  Bottom Layer w0.254: C15.2 32.32,12.44 v1(32.77,12.44) 33.66,12.44 33.91,12.19 33.91,11.43 Y1.1
ECO_OUT: length 10.5
  Top Layer w0.254: U1.53 33.12,9.5 33.08,9.55 33.08,9.81 33.26,9.98 34.75,9.98 35.18,10.41 35.18,12.19 35.43,12.44 v1(36.7,12.44)
  Bottom Layer w0.254: 35.53,13.56 35.53,12.85 35.94,12.44 v1(36.7,12.44) 36.99,12.44 C16.1
HOA1: length 1.4
  Bottom Layer w0.381: v1(16.89,24) 16.9,24 U2.19
HOA2: length 9.2
  Top Layer w0.254: R13.2 53.59,13.26 v1(54.61,13.26)
  VCC w0.254: v1(54.33,18.99) 54.61,18.71 v1(54.61,13.26)
  Bottom Layer w0.254: U5.19 54.13,19.19 v1(54.33,18.99)
HOB1: length 10.6
  Top Layer w0.381: v1(15.75,15.49) 15.75,13.97 16.13,13.58 16.74,13.58 R7.2
  VCC w0.254: v1(15.62,21.61) 15.75,21.48 v1(15.75,15.49)
  Bottom Layer w0.254: v1(15.62,21.61) 16.61,21.61 16.86,21.35 U2.16
HOB2: length 4
  Top Layer w0.254: v1(54.48,20.64) 54.48,21.97 54.32,22.13 R14.2
  Bottom Layer w0.254: U5.16 54.27,20.85 v1(54.48,20.64)
HOC1: length 16.1
  VCC w0.254: v1(16.38,19.64) 16.38,4.82 v1(16.64,4.57)
  Bottom Layer w0.254: v1(16.38,19.64) 16.59,19.85 U2.13
HOC2: length 10.4
  Top Layer w0.254: R15.2 53.38,31.11 v1(54.36,31.11)
  VCC w0.254: v1(54.36,23.87) v1(54.36,31.11)
  Bottom Layer w0.254: v1(54.36,23.87) 52.96,22.48 U5.13
KEYMOD: length 27.4
  Top Layer w0.254: v1(41.96,6.09) 41.96,6.67 41.78,6.85 39.88,6.85 39.34,7.39 39.34,16.99 39.61,17.25 U1.15 ; R9.1 53.48,4.94 53.1,5.31 47.01,5.31 46.74,5.58 v1(46.74,6.09)
  Bottom Layer w0.254: v1(41.96,6.09) v1(46.74,6.09)
LEDMOD: length 16.8
  Top Layer w0.254: v1(42.42,16.81) 42.35,16.75 U1.14 ; LED2.1 v1(45.38,5.46)
  VCC w0.254: v1(45.38,5.46) 45.38,15.95 44.52,16.81 v1(42.42,16.81)
LOA1: length 32.8
  Top Layer w0.254: v1(8.38,31.24) 8.38,30.22 R16.2
  VCC w0.254: v1(8.38,31.24) 12.06,31.24 13.84,29.46 v1(13.84,13.66)
  Bottom Layer w0.254: v1(13.84,13.66) 17.6,13.66 18.39,14.45 U2.11
LOA2: length 46.6
  Top Layer w0.254: v1(62.74,5.84) 61.62,5.84 61.58,5.87
  VCC w0.254: v1(45.97,26.46) 45.97,21.08 47.12,19.93 61.85,19.93 62.74,19.05 v1(62.74,5.84)
  Bottom Layer w0.254: U5.11 51.82,23.02 51.82,26.16 51.44,26.54 46.05,26.54 v1(45.97,26.46)
LOB1: length 27.5
  Top Layer w0.254: v1(8.51,22.86) 8.54,22.83 R18.2
  VCC w0.254: v1(8.51,22.86) 12.32,22.86 12.45,22.73 v1(12.45,13.08)
  Bottom Layer w0.254: U2.10 18.89,13.93 18.03,13.08 v1(12.45,13.08)
LOB2: length 35.4
  Top Layer w0.254: v1(63.63,14.85) 63.58,14.9 61.58,14.9
  VCC w0.254: v1(47.05,25.78) 47.05,22.41 47.75,21.71 62.74,21.71 63.63,20.82 v1(63.63,14.85)
  Bottom Layer w0.254: v1(47.05,25.78) 50.93,25.78 51.31,25.39 51.31,23.01 U5.10
LOC1: length 18.2
  Top Layer w0.254: v1(11.6,13.08) 8.89,13.08 8.54,12.72 R19.2
  Bottom Layer w0.254: v1(11.6,13.08) 11.6,12.66 11.81,12.44 18.16,12.44 19.39,13.67 U2.9
LOC2: length 20.8
  Top Layer w0.254: v1(61.59,22.73) 61.59,23.9 61.58,23.92
  VCC w0.254: v1(61.59,22.73) 48.9,22.73 48.31,23.31 v1(48.31,25.14)
  Bottom Layer w0.254: U5.9 50.8,24.5 50.16,25.14 v1(48.31,25.14)
PWM1AH: length 27.1
  Top Layer w0.254: U1.38 30.11,15.25 30.61,15.74 v1(30.61,16.63)
  Bottom Layer w0.254: U2.22 19.39,26.5 19.81,26.92 28.45,26.92 28.96,26.41 28.96,17.14 29.46,16.63 v1(30.61,16.63)
PWM1AL: length 17.4
  Top Layer w0.254: v1(26.62,14.73) 29.1,14.73 U1.39
  Bottom Layer w0.254: v1(26.62,14.73) 26.92,14.73 27.84,15.64 27.84,22.07 27.56,22.35 U2.1
PWM1BH: length 27.6
  Top Layer w0.254: v1(27.56,12.57) 27.88,12.25 U1.44
  Bottom Layer w0.254: U2.23 19.89,26.08 20.23,26.41 28.07,26.41 28.6,25.88 28.6,14.63 27.56,13.58 v1(27.56,12.57)
PWM1BL: length 20.4
  Top Layer w0.254: v1(25.17,14.34) 25.17,13.18 26.6,11.75 U1.45
  Bottom Layer w0.254: v1(25.17,14.34) 25.41,14.34 27.43,16.37 27.43,21.46 27.04,21.85 U2.2
PWM1CH: length 31.8
  Top Layer w0.254: U1.46 25.96,11.25 24.53,12.67 v1(24.53,13.84)
  Bottom Layer w0.254: v1(24.53,13.84) 24.61,13.76 26.92,13.76 28.19,15.03 28.19,25.52 27.81,25.9 20.57,25.9 20.39,25.72 U2.24
PWM1CL: length 22.6
  Top Layer w0.254: v1(24,14.85) 23.95,14.8 23.95,12.12 25.31,10.75 U1.47
  Bottom Layer w0.254: v1(24,14.85) 24.08,14.93 25.35,14.93 27.08,16.66 27.08,20.67 26.4,21.35 U2.3
PWM2AH: length 17.4
  Top Layer w0.254: U1.3 47.32,11.25
  Bottom Layer w0.254: U5.22 50.8,14.73 50.42,14.35 48.01,14.35 47.5,13.84 v1(47.5,11.3)
PWM2AL: length 16.3
  Top Layer w0.254: v1(47.14,17.1) 47.29,17.1 47.7,16.68 47.7,13.28 46.17,11.75 U1.4
  Bottom Layer w0.254: U5.1 48.87,19.58 48.87,17.37 48.6,17.1 v1(47.14,17.1)
PWM2BH: length 15.2
  Top Layer w0.254: U1.5 45.53,12.25 46.99,13.71 v1(46.99,15.36)
  Bottom Layer w0.254: v1(46.99,15.36) 49.4,15.36 50.3,16.26 U5.23
PWM2BL: length 15
  Top Layer w0.254: v1(46.35,17.77) 46.35,14.22 44.89,12.75 U1.6
  Bottom Layer w0.254: v1(46.35,17.77) 48.26,17.77 48.52,18.03 48.52,20.1 48.77,20.35 U5.2
PWM2CH: length 13.8
  Top Layer w0.254: v1(45.77,16.39) 45.77,14.65 44.37,13.25 U1.7
  Bottom Layer w0.254: v1(45.77,16.39) 48.91,16.39 49.8,17.29 U5.24
PWM2CL: length 14.5
  Top Layer w0.254: v1(45.13,18.36) 45.13,15.16 43.73,13.75 U1.8
  Bottom Layer w0.254: U5.3 48.32,20.85 48.16,20.7 48.16,18.69 47.83,18.36 v1(45.13,18.36)
RST: length 10.9
  Top Layer w0.381: R1.2 27.06,5.96 R4.2 ; R4.2 25.46,5.84 C7.2 ; R4.2 27.19,2.16 v1(27.18,2.15) 26.31,2.15 S1.1
  Bottom Layer w0.381: 29.92,2.25 29.82,2.15 v1(27.18,2.15)
SWCLK: length 6.8
  Top Layer w0.254: U1.62 37.62,6.31 38.3,5.63 v1(38.48,5.63)
  Bottom Layer w0.254: 37.54,2.25 37.54,3.75 38.48,4.69 v1(38.48,5.63)
SWDIO: length 7.7
  Top Layer w0.254: U1.63 38.12,6.58 38.48,6.22 v1(40,6.22)
  Bottom Layer w0.254: 40.08,2.25 40,2.33 v1(40,6.22)
UART_RX: length 13.1
  Top Layer w0.254: U1.18 38.12,21.31 v1(38.1,21.33)
  Bottom Layer w0.254: v1(38.1,21.33) 38.61,21.33 38.91,21.64 38.91,26.49 38.74,26.67 34.67,26.67 34.28,27.05 R20.2
UART_TX: length 13.9
  Top Layer w0.254: v1(39.37,19.17) 39.37,18.66 39.12,18.41 37.85,18.41 37.62,18.63 U1.19
  Bottom Layer w0.254: R26.2 37.33,27.31 37.62,27.02 38.88,27.02 39.37,26.53 v1(39.37,19.17)
VBA1: length 8.1
  Bottom Layer w0.254: 15.23,26 15.91,26 18.39,23.51 U2.20
  Bottom Layer w0.381: 15.23,26 15.07,26.15 D4.1
VBA2: length 13
  Bottom Layer w0.254: 54.23,14.85 51.8,17.28 U5.20
  Bottom Layer w0.381: D5.1 57.8,16.14 57.8,13.46 57.42,13.08 56.03,13.08 C25.1
VBB1: length 5.7
  Bottom Layer w0.254: U2.17 16.87,21.85 16.62,22.09 16.62,22.11 16.51,22.22 14.75,22.22 C28.1
  Bottom Layer w0.381: C28.1 14.33,21.8 D6.1
VBB2: length 5.7
  Bottom Layer w0.254: U5.17 53.49,20.35 53.86,19.98 55.19,19.98 C29.1
  Bottom Layer w0.381: C29.1 57.54,20.24 D7.1
VBC1: length 7.2
  Bottom Layer w0.254: 14.24,17.63 14.24,18.68 15.91,20.35 U2.14
  Bottom Layer w0.381: 14.24,17.63 14.06,17.44 D8.1
VBC2: length 6.8
  Bottom Layer w0.254: U5.14 52.97,21.84 53.34,21.84 55.75,24.25 C35.1
  Bottom Layer w0.381: D9.1 56.31,25.18 C35.1
VREFH: length 7.4
  Top Layer w0.254: U1.29 32.62,18.65 32,18.03 v1(32,17.65)
  Bottom Layer w0.254: 33.29,17.63 32.03,17.63 v1(32,17.65)
  Bottom Layer w0.508: 33.29,17.63 35.29,17.63 ; 37.15,17.63 35.42,17.63
VREFL: length 10.2
  Top Layer w0.254: v1(32.13,16.23) 32.13,16.89 32.51,17.27 33.87,17.27 34.12,17.52 U1.26
  Bottom Layer w0.254: 33.29,16.23 v1(32.13,16.23)
  Bottom Layer w0.508: 37.15,16.23 35.3,16.23 35.29,16.23 33.29,16.23
VSA1: length 9.1
  Top Layer w0.381: v1(12.95,24.12) 12.95,27.02 Q7.9
  Bottom Layer w0.254: U2.18 16.88,22.35 14.24,24.99
  Bottom Layer w0.381: v1(12.95,24.12) 13.72,24.12 14.24,24.65 14.24,25
  vias: v1(1.56,27.94) v1(1.56,27.17) v1(2.51,27.94) v1(2.51,27.17) v1(8.51,26.88) v1(8.51,25.94) v1(10.7,26.87) v1(10.69,25.98)
VSA2: length 12.8
  Top Layer w0.381: v1(57.15,14.47) 57.15,9.9
  Bottom Layer w0.254: U5.18 53.49,19.85 53.72,19.63 54.54,19.63 55.23,18.93 C25.2
  Bottom Layer w0.381: C25.2 56.62,14.47 v1(57.15,14.47)
  vias: v1(61.13,9.49) v1(61.13,8.54) v1(66.73,9.36) v1(66.73,8.51) v1(67.67,9.36) v1(67.67,8.51)
VSB1: length 5.9
  Top Layer w0.381: 13.21,18.66 13.16,18.72 v1(13.16,18.79)
  Bottom Layer w0.254: U2.15 17.15,20.77 14.7,20.77 C28.2
  Bottom Layer w0.381: v1(13.16,18.79) 13.16,20.26 13.51,20.62 C28.2
  vias: v1(1.21,18.35) v1(1.21,17.4) v1(8.25,17.99) v1(8.25,17.05) v1(10.38,18.54) v1(10.69,17.78) v1(10.67,17.01) v1(11.2,18.64) v1(11.47,16.61) v1(11.86,18.4)
VSB2: length 10.4
  Top Layer w0.381: v1(59.44,18.54) 58.93,18.03 Q11.9
  Bottom Layer w0.254: U5.15 55.16,21.35 C29.2
  Bottom Layer w0.381: C29.2 59.13,21.64 59.44,21.33 v1(59.44,18.54)
  vias: v1(56.26,18.12) v1(56.26,17.17) v1(61.36,18.41) v1(61.36,17.46) v1(68.76,18.41) v1(68.76,17.46)
VSC1: length 18.2
  Top Layer w0.381: v1(14.73,14.47) 13.49,14.47 13.48,14.46 12.94,14.46 12.93,14.47 11.94,14.47 11.43,13.97 7.75,13.97 7.24,13.46 7.24,9.77 7.11,9.65
  Bottom Layer w0.254: C30.2 15.88,16.64 17.89,18.65 U2.12
  Bottom Layer w0.381: v1(14.73,14.47) 14.73,16.14 C30.2
  vias: v1(2.57,9.39) v1(2.7,8.5) v1(3.52,9.39) v1(3.65,8.5) v1(8.51,9.1) v1(8.51,8.16) v1(10.29,9.52) v1(10.29,8) v1(10.75,8.77) v1(11.32,9.53) v1(11.32,8.01) v1(11.81,8.77) v1(12.45,9.52) v1(12.45,8) v1(14.26,9.14) v1(15.21,9.14)
VSC2: length 5
  Bottom Layer w0.254: U5.12 54.76,25.47
  Bottom Layer w0.381: v1(55.5,26.79) 55.5,26.35 C35.2
  vias: v1(56.51,27.27) v1(56.51,26.32) v1(63.53,27.94) v1(66.34,28.21) v1(66.34,27.32) v1(67.28,28.21) v1(67.28,27.32)
$1N2554: length 6.8
  Top Layer w0.254: R4.1 29.2,6.34 33.27,6.34 33.62,6.69 U1.54
$1N4377: length 4.5
  Top Layer w0.381: R10.2 R9.2 56.99,4.31 S2.1
$1N4714: length 2.5
  Top Layer w0.381: LED1.2 49.91,1.91 R12.2
$1N4753: length 2.3
  Top Layer w0.381: R17.2 49.92,4.31 LED2.2
$2N2936: length 7.2
  Bottom Layer w0.381: U7.6 57.16,7.11 C31.2 57.46,6.85 58.04,6.85 58.42,6.47 58.42,4.06 58.09,3.73 L2.1
$2N2941: length 2.6
  Bottom Layer w0.381: C31.1 56.83,4.81 U7.1
$2N3613: length 7.9
  Bottom Layer w0.381: U4.6 24.71,7.11 C21.2 25.01,6.85 25.91,6.85 26.29,6.47 26.29,4.02 25.91,3.64 24.89,3.64
$2N3618: length 2.6
  Bottom Layer w0.381: U4.1 24.38,4.81 C21.1
$2N3786: length 2.7
  Bottom Layer w0.381: R20.1 32.77,30.24 P2.1
$2N3825: length 2.9
  Bottom Layer w0.381: R26.1 35.31,28.45 35.31,30.21 P2.2
$2N7405: length 1.7
  Top Layer w0.254: 53.47,11.62 53.47,10.05 53.4,9.98
$2N7407: length 1.7
  Top Layer w0.254: R14.1 53.47,19.06 53.4,18.99
$2N7409: length 1.7
  Top Layer w0.254: R15.1 53.4,29.58 53.4,28
$2N7411: length 1.3
  Top Layer w0.254: 60.07,23.92 59.75,24.24 Q12.4
$2N7413: length 1.2
  Top Layer w0.254: Q11.4 59.75,15.1 R24.1
$2N7415: length 1.2
  Top Layer w0.254: R21.1 59.75,6.07 Q10.4
$2N14646: length 5.1
  Top Layer w0.381: 16.72,25.81 16.69,25.78 16,25.78 15.62,25.39 15.62,22.86 15.97,22.51 R6.1
$2N14647: length 1.8
  Top Layer w0.254: Q2.4 16.78,16.86 R7.1
$2N14648: length 1.8
  Top Layer w0.254: 16.72,7.84 16.78,7.79 R11.1
$2N14649: length 1.4
  Top Layer w0.381: Q9.4 10.37,11.76 10.05,12.08
$2N14650: length 1.4
  Top Layer w0.381: 10.05,21.1 10.37,20.78 Q8.4
$2N14651: length 1.3
  Top Layer w0.381: Q7.4 10.37,29.75 10.05,30.07
$2N21955: length 6.1
  Bottom Layer w0.381: U4.3 19.43,4.81 R22.1 ; R22.1 R23.2 ; R22.1 19.17,3.86 18.29,2.98
$2N22020: length 6.2
  Bottom Layer w0.381: R38.1 51.68,4.24 50.42,2.98 ; R38.1 R45.2 ; R38.1 51.94,4.81 53.24,4.81
$2N29420: length 45.1
  Bottom Layer w0.254: 21.97,15.54 25.45,15.54 26.29,16.38 26.29,20.22 26.03,20.48 R3.1 24.68,20.49 C36.1 22.21,20.85 U2.4
  Bottom Layer w0.762: D10.1 21.97,16.78 21.97,12.5 21.28,11.81 10.29,11.81 9.52,12.57 D8.2 D6.2 D4.2
$2N29442: length 36.9
  Bottom Layer w0.254: D11.1 45.06,21.37 ; 45.06,21.37 45.07,21.38 C39.1 47.21,21.35 U5.4 ; 45.06,21.37 R5.1
  Bottom Layer w0.762: D11.1 45.14,23.69 45.14,27.06 46.65,28.57 58.8,28.57 60.48,26.89 D9.2 D7.2 D5.2

## Copper pours and planes (outline as drawn; the poured copper is in the pictures)
GND on Top Layer: 34.62,9.22 35.06,9.22 35.06,6.83 34.62,6.83
GND on Top Layer: -1.27,47.75 75.56,47.75 75.56,-6.23 -1.27,-6.23
GND on Bottom Layer: -6.1,42.67 84.07,42.67 84.07,-11.31 -6.1,-11.31
GND on VCC: -7.62,43.81 80.01,43.81 80.01,-11.56 -7.62,-11.56
GND on GND: -4.83,43.56 77.47,43.56 77.47,-8.26 -4.83,-8.26
VBAT on Top Layer: 26.92,39.62 35,39.62 35,29 26.92,29
VBAT on Top Layer: 17.46,31.49 52.58,31.49 52.58,28.95 17.46,28.95
VBAT on Top Layer: 23.62,34.8 25.29,34.8 25.29,32.42 23.62,32.42
VBAT on Top Layer: 7.33,37.37 34.51,37.37 34.51,33.63 7.33,33.63
VBAT on Top Layer: 44.64,34.29 46.31,34.29 46.31,30.01 44.64,30.01
VBAT on Top Layer: 40.96,37.5 63.1,37.5 63.1,33.5 40.96,33.5
VBAT on Top Layer: 17.56,30.86 20.45,30.86 20.45,4.95 17.56,4.95
VBAT on Top Layer: 49.75,31.02 52.64,31.02 52.64,5.74 49.75,5.74
VBAT on Bottom Layer: 42.56,37.39 48.12,37.39 48.12,31.75 42.56,31.75
VBAT on Bottom Layer: 7.33,37.37 27.66,37.37 27.66,34.64 7.33,34.64
VBAT on Bottom Layer: 42.51,37.5 62.83,37.5 62.83,35.02 42.51,35.02
VBAT on Bottom Layer: 22,37.33 27.56,37.33 27.56,31.69 22,31.69
VBAT on GND: 7.33,37.37 34.51,37.37 34.51,33.63 7.33,33.63
VBAT on GND: 17.56,30.86 20.45,30.86 20.45,4.95 17.56,4.95
VBAT on GND: 49.75,31.02 52.64,31.02 52.64,5.74 49.75,5.74
VBAT on GND: 40.96,37.5 63.1,37.5 63.1,33.5 40.96,33.5
VBAT on GND: 17.46,31.49 52.54,31.49 52.54,28.95 17.46,28.95
VBAT on GND: 26.92,39.62 35,39.62 35,29 26.92,29
VSA1 on Top Layer: 0.51,28.82 17.4,28.82 17.4,25.01 0.51,25.01
VSA1 on GND: 0.51,28.82 17.4,28.82 17.4,25.01 0.51,25.01
VSA2 on Top Layer: 52.87,10.93 69.6,10.93 69.6,7.12 52.87,7.12
VSA2 on GND: 53.09,10.92 69.56,10.92 69.56,7.11 53.09,7.11
VSB1 on Top Layer: 0.55,19.88 17.32,19.88 17.32,16.07 0.55,16.07
VSB1 on GND: 0.55,19.88 17.32,19.88 17.32,16.07 0.55,16.07
VSB2 on Top Layer: 52.83,18.66 56.82,18.66 57.4,19.25 57.4,19.68 57.85,20.13 69.28,20.13 69.6,19.81 69.6,16.25 69.22,15.87 61.1,15.87 60.5,16.47 52.83,16.47
VSB2 on GND: 53.12,19.84 69.6,19.84 69.6,16.03 53.12,16.03
VSC1 on Top Layer: 0.5,10.8 17.27,10.8 17.27,6.99 0.5,6.99
VSC1 on GND: 0.5,10.8 17.27,10.8 17.27,6.99 0.5,6.99
VSC2 on Top Layer: 52.87,28.95 69.6,28.95 69.6,25.14 52.87,25.14
VSC2 on GND: 53.12,28.95 69.6,28.95 69.6,25.14 53.12,25.14
$1N5000 on Bottom Layer: 34.42,25.22 37,25.22 37,22.74 34.42,22.74
$2N2919 on Bottom Layer: 51.69,9.83 58.17,9.83 58.17,6.57 51.69,6.57
$2N3608 on Bottom Layer: 19.19,9.8 25.67,9.8 25.67,6.53 19.19,6.53

Small or netless copper shapes (teardrops, artwork), in the pictures only: 146 on Top Layer, 296 on Bottom Layer, 30 on VCC

## Text on the board
Bottom Silkscreen Layer: RST | NC | RX | TX | CLK | DIO | GND
Top Silkscreen Layer: TX | GND | 3V3 | RX | A | C | B | + | -
